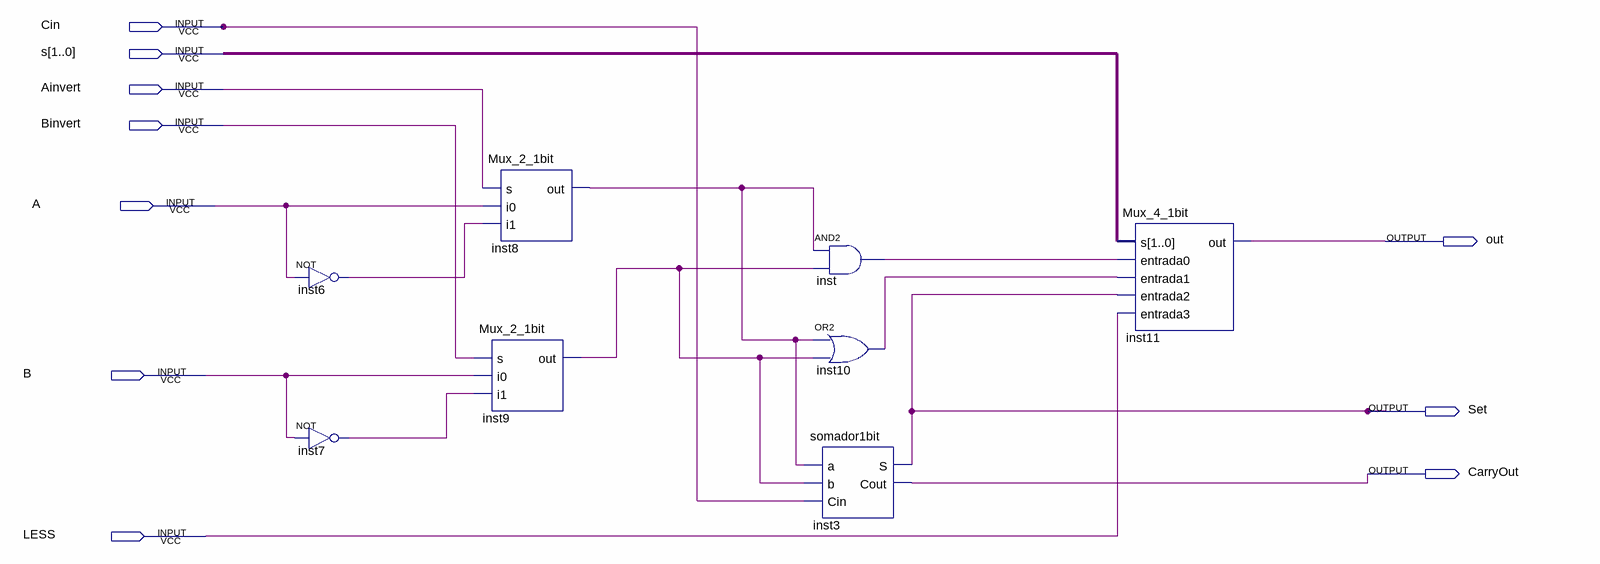
[diagram p0: schematic sheet]
// Quartus schematic ula1bit.bdf as structural Verilog: 8 symbols, 10 pins
module ula1bit (
  input  Cin,
  input  [1:0] s,
  input  Ainvert,
  input  Binvert,
  input  A,
  input  B,
  input  LESS,
  output out,
  output Set,
  output CarryOut
);

  wire inst6_out, inst7_out, inst8_out, inst9_out, inst10_out, inst_out;

  not inst6 (inst6_out, A);
  not inst7 (inst7_out, B);
  Mux_2_1bit inst8 (.s(Ainvert), .i0(A), .i1(inst6_out), .out(inst8_out));
  Mux_2_1bit inst9 (.s(Binvert), .i0(B), .i1(inst7_out), .out(inst9_out));
  somador1bit inst3 (.a(inst8_out), .b(inst9_out), .Cin(Cin), .S(Set), .Cout(CarryOut));
  and inst (inst_out, inst8_out, inst9_out);
  or inst10 (inst10_out, inst8_out, inst9_out);
  Mux_4_1bit inst11 (.s(s), .entrada0(inst_out), .entrada1(inst10_out), .entrada2(Set), .entrada3(LESS), .out(out));
endmodule
